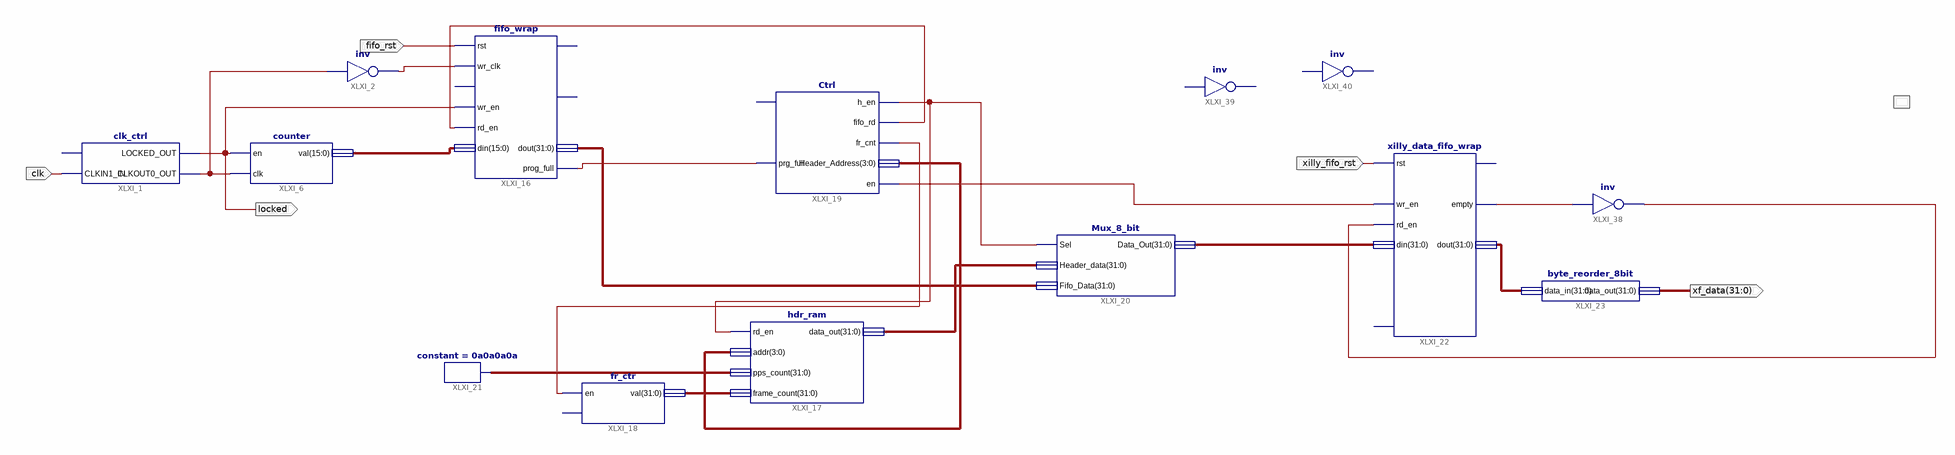
[diagram p0: schematic sheet 1]
// Xilinx ISE schematic xillyctr_test.sch (virtex5) as structural Verilog: 14 symbols, 5 ports
module xillyctr_test (
  input  fifo_rst,
  input  clk,
  input  xilly_fifo_rst,
  output locked,
  output [31:0] xf_data
);

  wire samp_clk, XLXN_11, XLXN_13, XLXN_16, XLXN_18, XLXN_19, XLXN_27, XLXN_90, XLXN_91;
  wire [3:0] ram_addr;
  wire [15:0] XLXN_3;
  wire [31:0] mux_data, XLXN_14, XLXN_21, XLXN_22, XLXN_32, XLXN_41;

  clk_ctrl XLXI_1 (.CLKIN1_IN(clk), .LOCKED_OUT(locked), .CLKOUT0_OUT(samp_clk));  // open: RST_IN
  not XLXI_2 (XLXN_13, samp_clk);
  hdr_ram XLXI_17 (.rd_en(XLXN_18), .addr(ram_addr), .pps_count(XLXN_32), .frame_count(XLXN_14), .data_out(XLXN_21));
  fr_ctr XLXI_18 (.en(XLXN_11), .val(XLXN_14));  // open: clk
  fifo_wrap XLXI_16 (
    .rst(fifo_rst), .wr_clk(XLXN_13), .wr_en(locked), .rd_en(XLXN_16), .din(XLXN_3), .dout(XLXN_22),
    .prog_full(XLXN_19));  // open: rd_clk, full, empty
  counter XLXI_6 (.en(locked), .clk(samp_clk), .val(XLXN_3));
  Mux_8_bit XLXI_20 (.Sel(XLXN_18), .Header_data(XLXN_21), .Fifo_Data(XLXN_22), .Data_Out(mux_data));
  constant #(.CValue("0a0a0a0a")) XLXI_21 (.O(XLXN_32));
  xilly_data_fifo_wrap XLXI_22 (
    .rst(xilly_fifo_rst), .wr_en(XLXN_27), .rd_en(XLXN_91), .din(mux_data), .empty(XLXN_90), .dout(XLXN_41));  // open: full, clk
  Ctrl XLXI_19 (
    .prg_full(XLXN_19), .h_en(XLXN_18), .fifo_rd(XLXN_16), .fr_cnt(XLXN_11), .Header_Address(ram_addr),
    .en(XLXN_27));  // open: clk
  byte_reorder_8bit XLXI_23 (.data_in(XLXN_41), .data_out(xf_data));
  not XLXI_38 (XLXN_91, XLXN_90);
  // inv XLXI_39 is placed but not wired
  // inv XLXI_40 is placed but not wired
endmodule
